# Altium schematic sheet 48PinConnector.SchDoc
size A; SheetNumber: 3; SheetTotal: 3
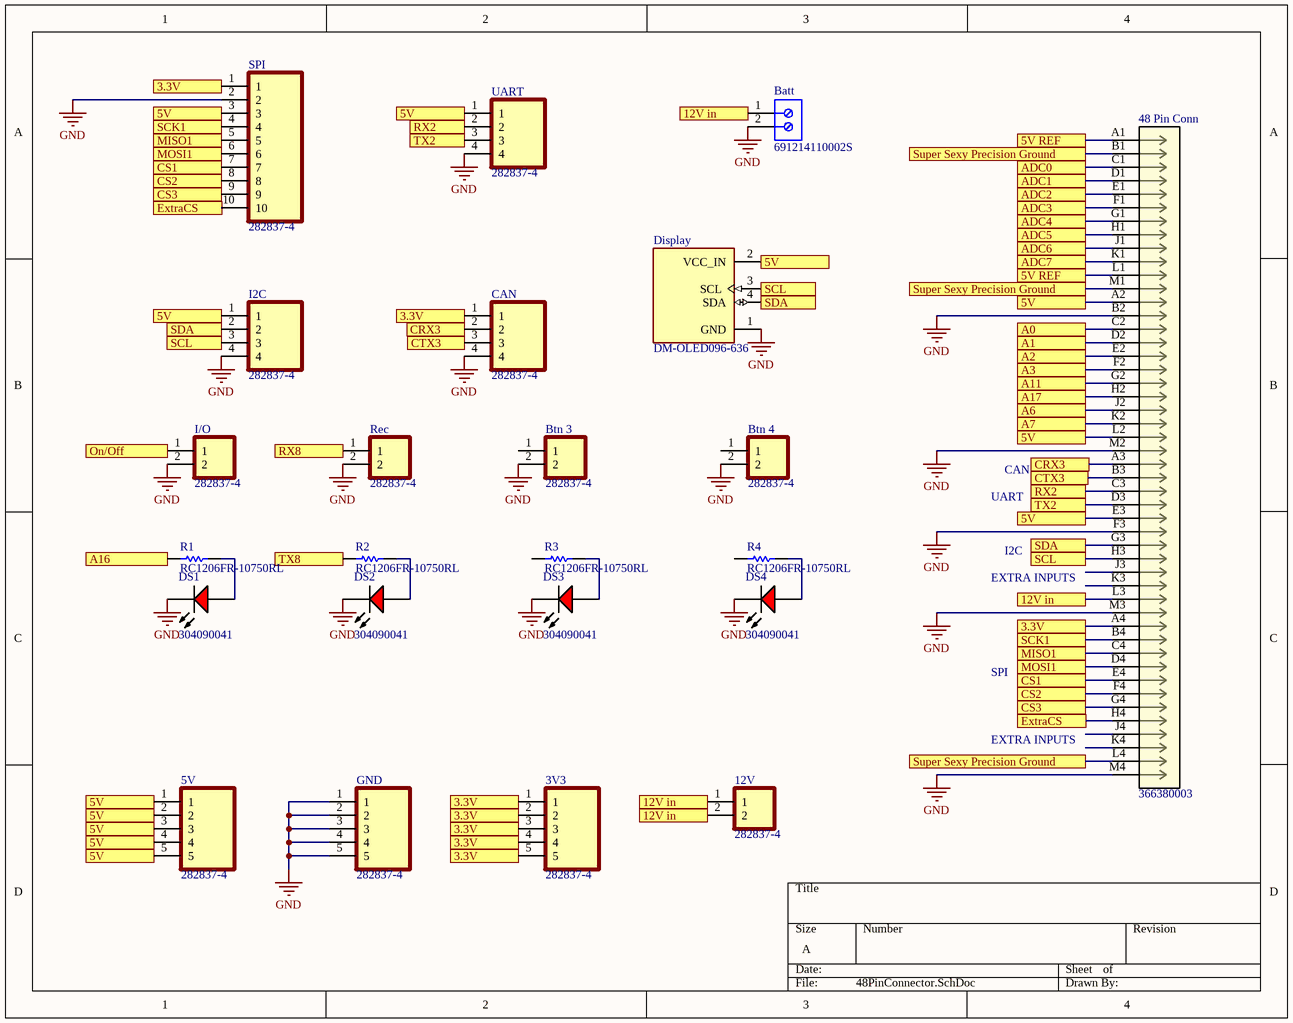
[diagram p0: 48PinConnector.SchDoc]

## Parts
3V3  282837-4  [TE_282837-4]
5V  282837-4  [TE_282837-4]
12V  282837-4  [TE_282837-4]
48_Pin_Conn  366380003  [CONN_36638-0003_MOL]
Batt  691214110002S  [691214110002S]
Btn_3  282837-4  [TE_282837-4]
Btn_4  282837-4  [TE_282837-4]
CAN  282837-4  [TE_282837-4]
Display  DM-OLED096-636  [MODULE_DM-OLED096-636]
DS1  304090041  [LED-2P-2.28-3MM_A]
DS2  304090041  [LED-2P-2.28-3MM_A]
DS3  304090041  [LED-2P-2.28-3MM_A]
DS4  304090041  [LED-2P-2.28-3MM_A]
GND  282837-4  [TE_282837-4]
I2C  282837-4  [TE_282837-4]
I/O  282837-4  [TE_282837-4]
R1  RC1206FR-10750RL  [RESC3116X65X40LL10T20]
R2  RC1206FR-10750RL  [RESC3116X65X40LL10T20]
R3  RC1206FR-10750RL  [RESC3116X65X40LL10T20]
R4  RC1206FR-10750RL  [RESC3116X65X40LL10T20]
Rec  282837-4  [TE_282837-4]
SPI  282837-4  [TE_282837-4]
UART  282837-4  [TE_282837-4]

## Ports
3.3V (see 48PinConnector[1A], 48PinConnector[2B], 48PinConnector[2D], 48PinConnector[4C], MainSchematic.2[1C], MainSchematic.2[1D], MainSchematic.2[2A], MainSchematic.2[5A], MainSchematic.2[5B], MainSchematic.2[5C]), 3.3V (see 48PinConnector[1A], 48PinConnector[2B], 48PinConnector[2D], MainSchematic.2[1C], MainSchematic.2[1D], MainSchematic.2[2A], MainSchematic.2[5A], MainSchematic.2[5B], MainSchematic.2[5C]), 3.3V (see 48PinConnector[1A], 48PinConnector[2D], 48PinConnector[4C], MainSchematic.2[1C], MainSchematic.2[1D], MainSchematic.2[2A], MainSchematic.2[5A], MainSchematic.2[5B], MainSchematic.2[5C]), 3.3V (see 48PinConnector[2B], 48PinConnector[2D], 48PinConnector[4C], MainSchematic.2[1C], MainSchematic.2[1D], MainSchematic.2[2A], MainSchematic.2[5A], MainSchematic.2[5B], MainSchematic.2[5C]), 5V (see 48PinConnector[1A], 48PinConnector[1B], 48PinConnector[1D], 48PinConnector[2A], 48PinConnector[3B], 48PinConnector[4B], 48PinConnector[4C], MainSchematic.2[1C], MainSchematic.2[2B], MainSchematic.2[5A], MainSchematic.2[6B]), 5V (see 48PinConnector[1A], 48PinConnector[1B], 48PinConnector[1D], 48PinConnector[2A], 48PinConnector[3B], 48PinConnector[4B], MainSchematic.2[1C], MainSchematic.2[2B], MainSchematic.2[5A], MainSchematic.2[6B]), 5V (see 48PinConnector[1A], 48PinConnector[1B], 48PinConnector[1D], 48PinConnector[2A], 48PinConnector[4B], 48PinConnector[4C], MainSchematic.2[1C], MainSchematic.2[2B], MainSchematic.2[5A], MainSchematic.2[6B]), 5V (see 48PinConnector[1A], 48PinConnector[1B], 48PinConnector[1D], 48PinConnector[3B], 48PinConnector[4B], 48PinConnector[4C], MainSchematic.2[1C], MainSchematic.2[2B], MainSchematic.2[5A], MainSchematic.2[6B]), 5V (see 48PinConnector[1A], 48PinConnector[1D], 48PinConnector[2A], 48PinConnector[3B], 48PinConnector[4B], 48PinConnector[4C], MainSchematic.2[1C], MainSchematic.2[2B], MainSchematic.2[5A], MainSchematic.2[6B]), 5V (see 48PinConnector[1B], 48PinConnector[1D], 48PinConnector[2A], 48PinConnector[3B], 48PinConnector[4B], 48PinConnector[4C], MainSchematic.2[1C], MainSchematic.2[2B], MainSchematic.2[5A], MainSchematic.2[6B]), 5V REF (see 48PinConnector[4A], MainSchematic.2[2C], MainSchematic.2[5C]), 5V REF (see 48PinConnector[4B], MainSchematic.2[2C], MainSchematic.2[5C]), 12V in (see 48PinConnector[2D], 48PinConnector[3A], 48PinConnector[4C], MainSchematic.2[5B], MainSchematic.2[5C]), 12V in (see 48PinConnector[2D], 48PinConnector[3A], MainSchematic.2[5B], MainSchematic.2[5C]), 12V in (see 48PinConnector[2D], 48PinConnector[4C], MainSchematic.2[5B], MainSchematic.2[5C]), A0 (see MainSchematic.2[1A], MainSchematic.2[5A]), A1 (see MainSchematic.2[1A], MainSchematic.2[5A]), A2 (see MainSchematic.2[1B], MainSchematic.2[5A]), A3 (see MainSchematic.2[1B], MainSchematic.2[5A]), A6 (see MainSchematic.2[1B], MainSchematic.2[5A]), A7 (see MainSchematic.2[1B], MainSchematic.2[5A]), A11 (see MainSchematic.2[1B], MainSchematic.2[5B]), A16 (see MainSchematic.2[2A], MainSchematic.2[5B]), A17 (see MainSchematic.2[2A], MainSchematic.2[5B]), ADC0 (see Filters.2[1A], MainSchematic.2[2B]), ADC1 (see Filters.2[1A], MainSchematic.2[2C]), ADC2 (see Filters.2[1A], MainSchematic.2[2C]), ADC3 (see Filters.2[1B], MainSchematic.2[2C]), ADC4 (see Filters.2[1B], MainSchematic.2[2C]), ADC5 (see Filters.2[1C], MainSchematic.2[2C]), ADC6 (see Filters.2[1C], MainSchematic.2[2C]), ADC7 (see Filters.2[1C], MainSchematic.2[2C]), CRX3 (see 48PinConnector[2B], MainSchematic.2[1B], MainSchematic.2[5B]), CRX3 (see 48PinConnector[4B], MainSchematic.2[1B], MainSchematic.2[5B]), CS1 (see 48PinConnector[1A], MainSchematic.2[2B], MainSchematic.2[5A]), CS1 (see 48PinConnector[4C], MainSchematic.2[2B], MainSchematic.2[5A]), CS2 (see 48PinConnector[1A], MainSchematic.2[2A], MainSchematic.2[5B]), CS2 (see 48PinConnector[4C], MainSchematic.2[2A], MainSchematic.2[5B]), CS3 (see 48PinConnector[1A], MainSchematic.2[2A], MainSchematic.2[5B]), CS3 (see 48PinConnector[4C], MainSchematic.2[2A], MainSchematic.2[5B]), CTX3 (see 48PinConnector[2B], MainSchematic.2[2A], MainSchematic.2[5B]), CTX3 (see 48PinConnector[4B], MainSchematic.2[2A], MainSchematic.2[5B]), ExtraCS (see 48PinConnector[1A], MainSchematic.2[2A], MainSchematic.2[5B]), ExtraCS (see 48PinConnector[4C], MainSchematic.2[2A], MainSchematic.2[5B]), MISO1 (see 48PinConnector[1A], MainSchematic.2[1A], MainSchematic.2[5A]), MISO1 (see 48PinConnector[4C], MainSchematic.2[1A], MainSchematic.2[5A]), MOSI1 (see 48PinConnector[1A], MainSchematic.2[1B], MainSchematic.2[5B]), MOSI1 (see 48PinConnector[4C], MainSchematic.2[1B], MainSchematic.2[5B]), On/Off (see MainSchematic.2[2B]), RX2 (see 48PinConnector[2A], MainSchematic.2[1A], MainSchematic.2[4D], MainSchematic.2[5A]), RX2 (see 48PinConnector[4B], MainSchematic.2[1A], MainSchematic.2[4D], MainSchematic.2[5A]), RX8 (see MainSchematic.2[2A], MainSchematic.2[5B]), SCK1 (see 48PinConnector[1A], MainSchematic.2[1B], MainSchematic.2[5B]), SCK1 (see 48PinConnector[4C], MainSchematic.2[1B], MainSchematic.2[5B]), SCL (see 48PinConnector[1B], 48PinConnector[3B], MainSchematic.2[1B], MainSchematic.2[5A]), SCL (see 48PinConnector[1B], 48PinConnector[4C], MainSchematic.2[1B], MainSchematic.2[5A]), SCL (see 48PinConnector[3B], 48PinConnector[4C], MainSchematic.2[1B], MainSchematic.2[5A]), SDA (see 48PinConnector[1B], 48PinConnector[3B], MainSchematic.2[1B], MainSchematic.2[5A]), SDA (see 48PinConnector[1B], 48PinConnector[4C], MainSchematic.2[1B], MainSchematic.2[5A]), SDA (see 48PinConnector[3B], 48PinConnector[4C], MainSchematic.2[1B], MainSchematic.2[5A]), Super Sexy Precision Ground (see 48PinConnector[3A], 48PinConnector[3B], Filters.2[1A], Filters.2[1B], Filters.2[1C], MainSchematic.2[2C], MainSchematic.2[5C]), Super Sexy Precision Ground (see 48PinConnector[3A], 48PinConnector[3C], Filters.2[1A], Filters.2[1B], Filters.2[1C], MainSchematic.2[2C], MainSchematic.2[5C]), Super Sexy Precision Ground (see 48PinConnector[3B], 48PinConnector[3C], Filters.2[1A], Filters.2[1B], Filters.2[1C], MainSchematic.2[2C], MainSchematic.2[5C]), TX2 (see 48PinConnector[2A], MainSchematic.2[1A], MainSchematic.2[4D], MainSchematic.2[5A]), TX2 (see 48PinConnector[4B], MainSchematic.2[1A], MainSchematic.2[4D], MainSchematic.2[5A]), TX8 (see MainSchematic.2[2A], MainSchematic.2[5B])

## Nets
GND: 48_Pin_Conn.B2 48_Pin_Conn.F3 48_Pin_Conn.M2 48_Pin_Conn.M3 48_Pin_Conn.M4 Batt.2 Btn_3.2 Btn_4.2 CAN.4 Display.1(GND) DS1.2(K) DS2.2(K) DS3.2(K) DS4.2(K) GND.1 GND.2 GND.3 GND.4 GND.5 I2C.4 I/O.2 Rec.2 SPI.2 UART.4
3.3V: 3V3.1 3V3.2 3V3.3 3V3.4 3V3.5 48_Pin_Conn.A4 CAN.1 SPI.1 ; port 3.3V
5V: 5V.1 5V.2 5V.3 5V.4 5V.5 48_Pin_Conn.A2 48_Pin_Conn.E3 48_Pin_Conn.L2 Display.2(VCC_IN) I2C.1 SPI.3 UART.1 ; port 5V
5V REF: 48_Pin_Conn.A1 48_Pin_Conn.L1 ; port 5V REF
12V in: 12V.1 12V.2 48_Pin_Conn.L3 Batt.1 ; port 12V in
A0: 48_Pin_Conn.C2 ; port A0
A1: 48_Pin_Conn.D2 ; port A1
A2: 48_Pin_Conn.E2 ; port A2
A3: 48_Pin_Conn.F2 ; port A3
A6: 48_Pin_Conn.J2 ; port A6
A7: 48_Pin_Conn.K2 ; port A7
A11: 48_Pin_Conn.G2 ; port A11
A16: R1.1 ; port A16
A17: 48_Pin_Conn.H2 ; port A17
ADC0: 48_Pin_Conn.C1 ; port ADC0
ADC1: 48_Pin_Conn.D1 ; port ADC1
ADC2: 48_Pin_Conn.E1 ; port ADC2
ADC3: 48_Pin_Conn.F1 ; port ADC3
ADC4: 48_Pin_Conn.G1 ; port ADC4
ADC5: 48_Pin_Conn.H1 ; port ADC5
ADC6: 48_Pin_Conn.J1 ; port ADC6
ADC7: 48_Pin_Conn.K1 ; port ADC7
CRX3: 48_Pin_Conn.A3 CAN.2 ; port CRX3
CS1: 48_Pin_Conn.E4 SPI.7 ; port CS1
CS2: 48_Pin_Conn.F4 SPI.8 ; port CS2
CS3: 48_Pin_Conn.G4 SPI.9 ; port CS3
CTX3: 48_Pin_Conn.B3 CAN.3 ; port CTX3
ExtraCS: 48_Pin_Conn.H4 SPI.10 ; port ExtraCS
MISO1: 48_Pin_Conn.C4 SPI.5 ; port MISO1
MOSI1: 48_Pin_Conn.D4 SPI.6 ; port MOSI1
On/Off: I/O.1 ; port On/Off
RX2: 48_Pin_Conn.C3 UART.2 ; port RX2
RX8: Rec.1 ; port RX8
SCK1: 48_Pin_Conn.B4 SPI.4 ; port SCK1
SCL: 48_Pin_Conn.H3 Display.3(SCL) I2C.3 ; port SCL
SDA: 48_Pin_Conn.G3 Display.4(SDA) I2C.2 ; port SDA
Super Sexy Precision Ground: 48_Pin_Conn.B1 48_Pin_Conn.L4 48_Pin_Conn.M1 ; port Super Sexy Precision Ground
TX2: 48_Pin_Conn.D3 UART.3 ; port TX2
TX8: R2.1 ; port TX8
NetDS1_1: DS1.1(A) R1.2
NetDS2_1: DS2.1(A) R2.2
NetDS3_1: DS3.1(A) R3.2
NetDS4_1: DS4.1(A) R4.2

Not connected (* = marked no-connect by the designer): 48_Pin_Conn J3 J4 K3 K4; Btn_3 1; Btn_4 1; R3 1; R4 1

## Notes on the sheet
- UART
- CAN
- I2C
- EXTRA INPUTS
- SPI

## Library data of the parts
3V3 5V 12V Btn_3 Btn_4 CAN GND I2C I/O Rec SPI UART = 282837-4: 4 Position Wire to Board Terminal Block Horizontal with Board 0.200 (5.08mm) Through Hole; MF: TE Connectivity; Value: *; SnapEDA_Link: https://www.snapeda.com/parts/282837-4/TE+Connectivity+AMP+Connectors/view-part/?ref=snap; Purchase-URL: https://pricing.snapeda.com/search/part/282837-4/?ref=eda; EU_RoHS_Compliance: Compliant with Exemptions; Availability: In Stock; Price: None; Package: None; Check_prices: https://www.snapeda.com/parts/282837-4/TE+Connectivity+AMP+Connectors/view-part/?ref=eda; MP: 282837-4
48_Pin_Conn = 366380003: 2.50mm, 3.50mm CMC Header, Right-Angle, 48 Position, 1 Port, Brown, Peg,  Lead-Free; Manufacturer_Name: Molex Connector Corporation; Copyright: Copyright (C) 2025 Ultra Librarian. All rights reserved.; Manufacturer_Part_Number: 366380003; RefDes: RefDes; Type: Type
Batt = CMP-1502-02465-2: NexarPartId: 94172715; Voltage Rating: 300V; Number of Contacts: 2; Current Rating: 10A; Lead Pitch: 3.5mm; Height: 9.2mm; Min Operating Temperature: -30°C; Number of Pins: 2; Packaging: Box; Max Operating Temperature: 120°C; Contact Material: Nickel, Tin; Number of Rows: 1
Display = DM-OLED096-636: 0.96â€ 128 X 64 MONOCHROME GRAPHIC OLED DISPLAY MODULE - I2C; SnapEDA_Link: https://www.snapeda.com/parts/DM-OLED096-636/Display+Module/view-part/?ref=snap; Package: Package; Value: *; MF: Display Module; MP: DM-OLED096-636; Check_prices: https://www.snapeda.com/parts/DM-OLED096-636/Display+Module/view-part/?ref=eda
DS1-DS4 = CMP-007-00007-2: Red LED, 80 mW, 30 mA, -25 to 85 degC, 2-Pin THD; Manufacturer: Shenzhen CGX; Package Description: 2-Pin Through Hole Device, Dia 3 mm, Pitch 2.28 mm; Datasheet URL: http://datasheet.octopart.com/304090041-Chengguangxing-datasheet-62330656.pdf; Mounting Technology: TH; Manufacturer URL: http://szcgx.com/; RoHS Compliant: Unknown; Datasheet Version: Sep-14; Case/Package: 304090041; Package Reference: 304090041
R1-R4 = CMP-2003-04964-1: Manufacturer: Yageo; Part Number: RC1206FR-10750RL